# EAGLE schematic bmx160-breakout (EAGLE 9.6.2)
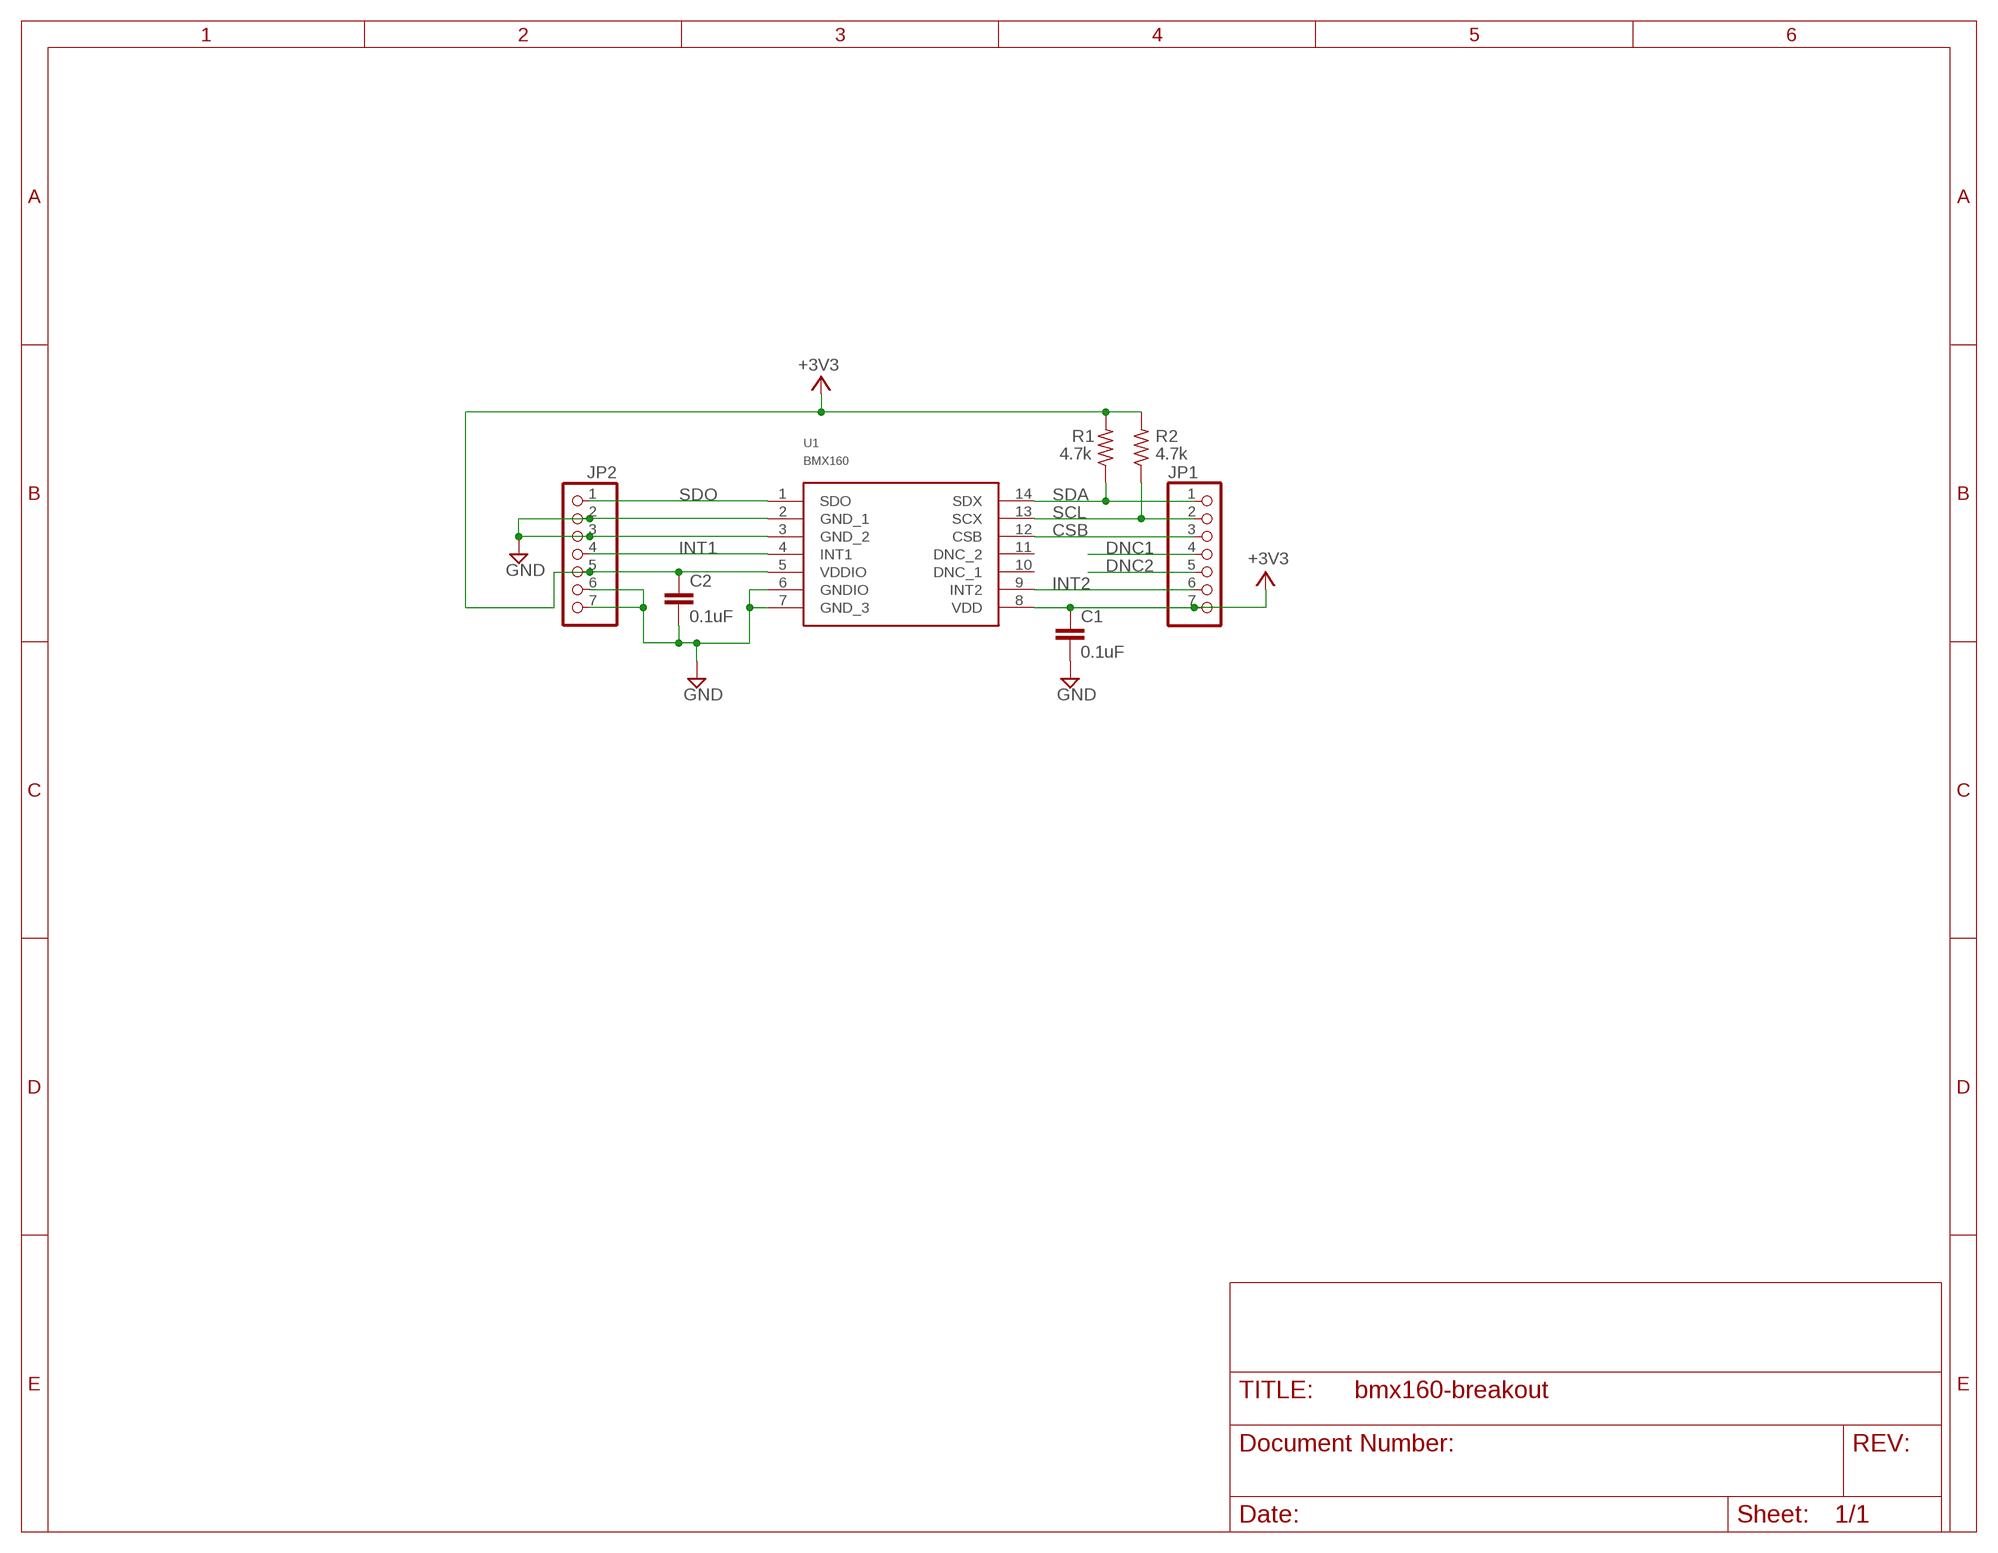
[diagram p0: schematic, sheet 1]

## Parts
C1  0.1uF  C-EUC0805  [C0805]
C2  0.1uF  C-EUC0805  [C0805]
JP1  PINHD-1X7  [1X07]
JP2  PINHD-1X7ALL_ROUND  [1X07*]
R1  4.7k  R-US_R0805  [R0805]
R2  4.7k  R-US_R0805  [R0805]
U1  BMX160  [QFN14P50_300X250X100L47X25N]

## Nets
+3V3: C1.1 C2.1 JP1.7 JP2.5 R1.2 R2.2 U1.5(VDDIO) U1.8(VDD)
CSB: JP1.3 U1.12(CSB)
DNC1: JP1.4
DNC2: JP1.5
GND: C1.2 C2.2 JP2.2 JP2.3 JP2.6 JP2.7 U1.2(GND_1) U1.3(GND_2) U1.6(GNDIO) U1.7(GND_3)
INT1: JP2.4 U1.4(INT1)
INT2: JP1.6 U1.9(INT2)
SCL: JP1.2 R2.1 U1.13(SCX)
SDA: JP1.1 R1.1 U1.14(SDX)
SDO: JP2.1 U1.1(SDO)
Unconnected: U1.10(DNC_1) U1.11(DNC_2)

## Library data of the parts
C1 C2 = rcl:C-EU: CAPACITOR, European symbol; SPICEPREFIX: C
JP1 JP2 = my_library:PINHD-1X7: PIN HEADER
R1 R2 = rcl:R-US_: RESISTOR, American symbol; SPICEPREFIX: R
U1 = my_library:BMX160